# EAGLE design PMOD Debug - CR6QEG (EAGLE 9.2.2)
LICENSE: CERN OHL v1.2; REV: CR6QEG; TITLE: PMOD Debug; URL: https://github.com/CapableRobot/PMOD-Adapters
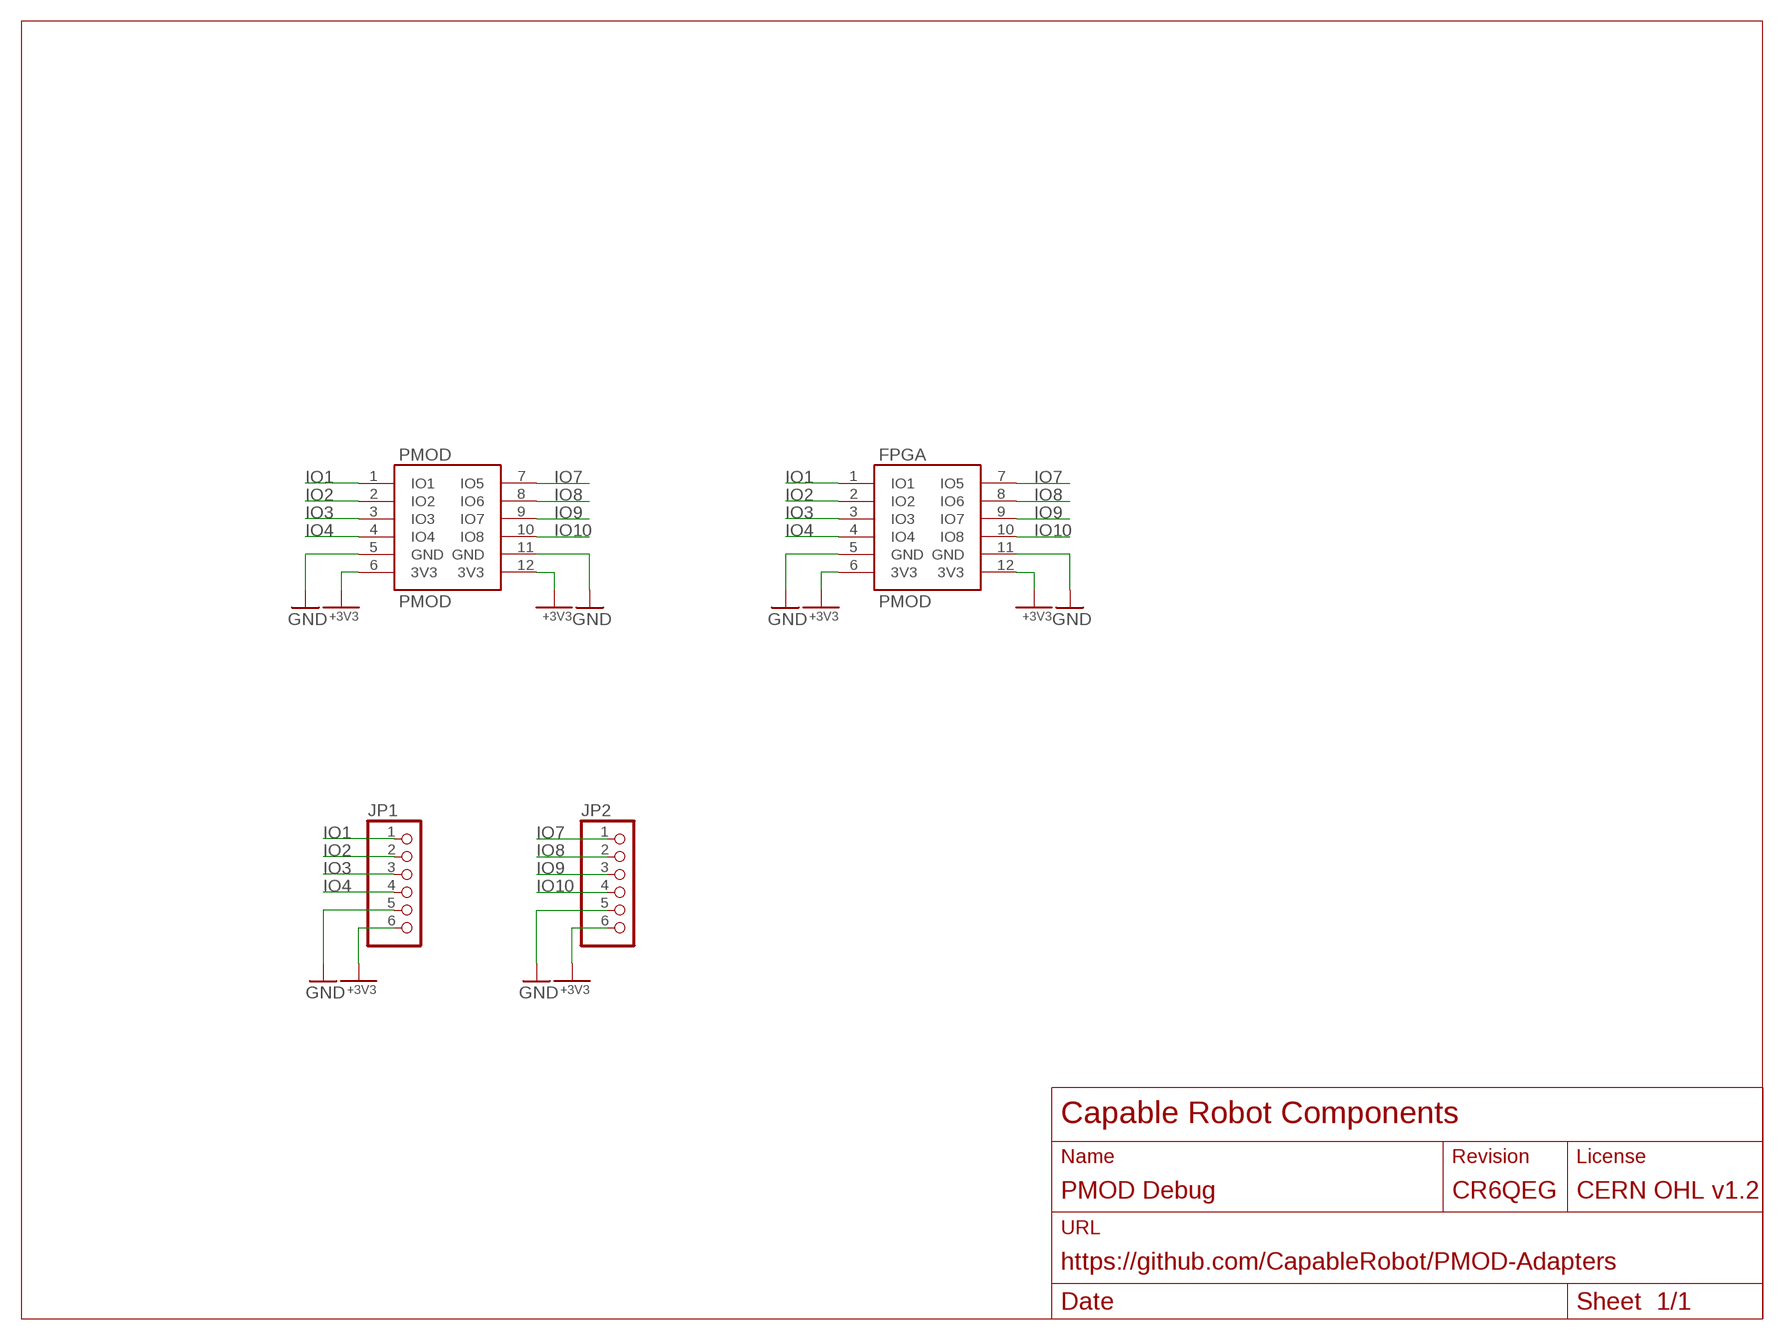
[diagram p0: schematic, sheet 1]

## Parts
FPGA  PMOD-PERIPH  [HDRRA12W64P254_2X6_1524X254X556B]
JP1  PINHD-1X6  [1X06]
JP2  PINHD-1X6  [1X06]
PMOD  PMOD-HOST  [HDRRAR12W64P254_2X6_1524X736X556B]

## Nets
+3V3: FPGA.6(3V3) FPGA.12(3V3) JP1.6 JP2.6 PMOD.6(3V3) PMOD.12(3V3)
GND: FPGA.5(GND) FPGA.11(GND) JP1.5 JP2.5 PMOD.5(GND) PMOD.11(GND)
IO1: FPGA.1(IO1) JP1.1 PMOD.1(IO1)
IO2: FPGA.2(IO2) JP1.2 PMOD.2(IO2)
IO3: FPGA.3(IO3) JP1.3 PMOD.3(IO3)
IO4: FPGA.4(IO4) JP1.4 PMOD.4(IO4)
IO7: FPGA.7(IO5) JP2.1 PMOD.7(IO5)
IO8: FPGA.8(IO6) JP2.2 PMOD.8(IO6)
IO9: FPGA.9(IO7) JP2.3 PMOD.9(IO7)
IO10: FPGA.10(IO8) JP2.4 PMOD.10(IO8)

## Library data of the parts
FPGA PMOD = CapableRobot:PMOD
JP1 JP2 = adafruit:PINHD-1X6: PIN HEADER

## Board
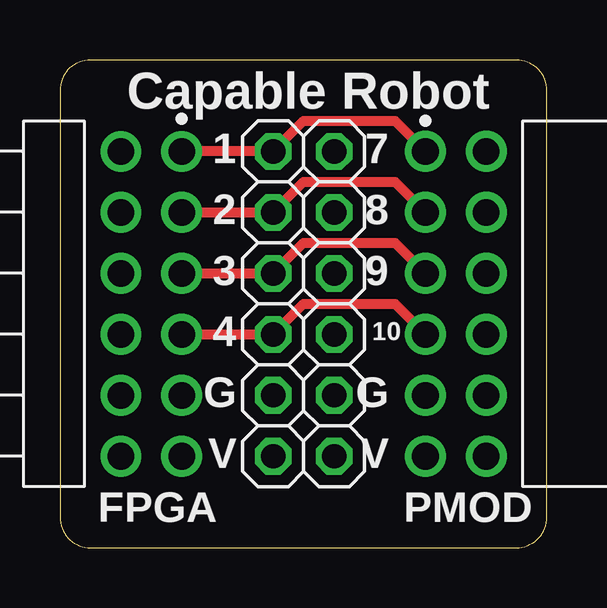
[diagram p1: board, top side]
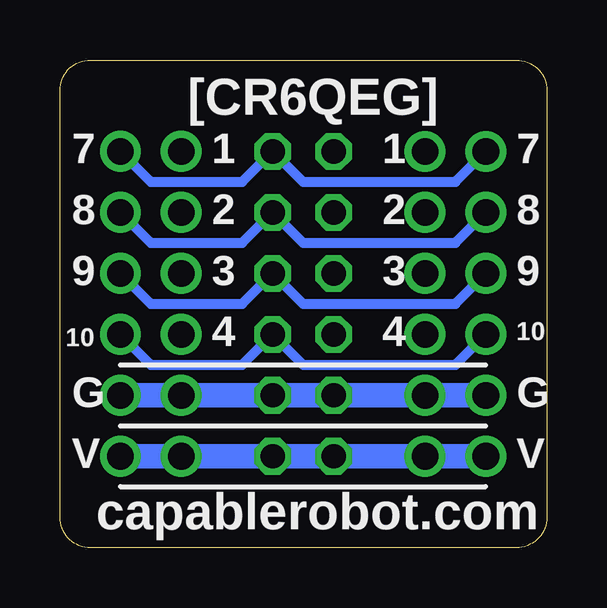
[diagram p2: board, bottom side, seen from below]

Size 20.3 x 20.32 mm. Coordinates in mm from the lower left corner, seen from the top.
Outline: 19.03,20.32 1.27,20.32 arc90 0,19.05 0,1.27 arc90 1.27,0 19.03,0 arc90 20.3,1.27 20.3,19.05 arc90 19.03,20.32
Copper layers (1*16): Top 0.035559375mm / dielectric 1.6mm / Bottom 0.035559375mm
Design rules "oshpark-2layer": minimum track width 6mil, minimum drill 10mil, track to track 6mil, track to pad 6mil, pad to pad 6mil, via to via 6mil, smd to smd 6mil, copper to edge 15mil, drill to drill 6mil, minimum pad ring 5mil, minimum via ring 5mil, stop-mask expansion 2.5mil, vias tented up to drill 0mil, thermal gap 10mil

### Footprints (pad centres in the part's own frame; a part is rotated, then mirrored left to right if it is on the bottom)
HDRRA12W64P254_2X6_1524X254X556B = drill 1.105 pad 1.702: 1 0,0; 2 2.54,0; 3 5.08,0; 4 7.62,0; 5 10.16,0; 6 12.7,0; 7 0,-2.54; 8 2.54,-2.54; 9 5.08,-2.54; 10 7.62,-2.54; 11 10.16,-2.54; 12 12.7,-2.54
1X06 = drill 1.016 octagon: 1 -6.35,0; 2 -3.81,0; 3 -1.27,0; 4 1.27,0; 5 3.81,0; 6 6.35,0
HDRRAR12W64P254_2X6_1524X736X556B = drill 1.105 pad 1.705: 1 12.7,0; 2 10.16,0; 3 7.62,0; 4 5.08,0; 5 2.54,0; 6 0,0; 7 12.7,-2.54; 8 10.16,-2.54; 9 7.62,-2.54; 10 5.08,-2.54; 11 2.54,-2.54; 12 0,-2.54

### Placement (x,y rotation side)
FPGA  5.08,16.51 270 top
JP1  8.89,10.16 270 top
JP2  11.43,10.16 270 top
PMOD  15.24,3.81 90 top

### Tracks (layer width: path | path; a pad name or v marks a point on that pad's centre or on a via)
+3V3
  Bottom 1.016: PMOD.12 PMOD.6 JP2.6 JP1.6 FPGA.6 FPGA.12
GND
  Bottom 1.016: FPGA.11 FPGA.5 JP1.5 JP2.5 PMOD.5 PMOD.11
IO1
  Top 0.406: PMOD.1 13.97,17.78 10.16,17.78 JP1.1 FPGA.1
IO2
  Top 0.406: PMOD.2 13.97,15.24 10.16,15.24 JP1.2 FPGA.2
IO3
  Top 0.406: PMOD.3 13.97,12.7 10.16,12.7 9.02,11.56 JP1.3 FPGA.3
IO4
  Top 0.406: PMOD.4 13.97,10.16 10.16,10.16 JP1.4 FPGA.4
IO7
  Bottom 0.406: PMOD.7 16.51,15.24 12.7,15.24 JP2.1 10.16,15.24 3.81,15.24 FPGA.7
IO8
  Bottom 0.406: PMOD.8 16.51,12.7 12.7,12.7 JP2.2 10.16,12.7 3.81,12.7 FPGA.8
IO9
  Bottom 0.406: PMOD.9 16.51,10.16 12.7,10.16 JP2.3 10.16,10.16 3.81,10.16 FPGA.9
IO10
  Bottom 0.406: PMOD.10 16.51,7.62 12.7,7.62 JP2.4 10.16,7.62 3.81,7.62 FPGA.10

### Text on the board
tPlace: Capable Robot | 1 | 7 | 2 | 8 | 3 | 9 | 4 | 10 | G | G | V | V
bPlace: [CR6QEG] | 7 | 1 | 1 | 7 | 8 | 2 | 2 | 8 | 9 | 3 | 3 | 9 | 10 | 4 | 4 | 10 | G | G | V | V | capablerobot.com